# Altium project BLMC-26.PrjPcb
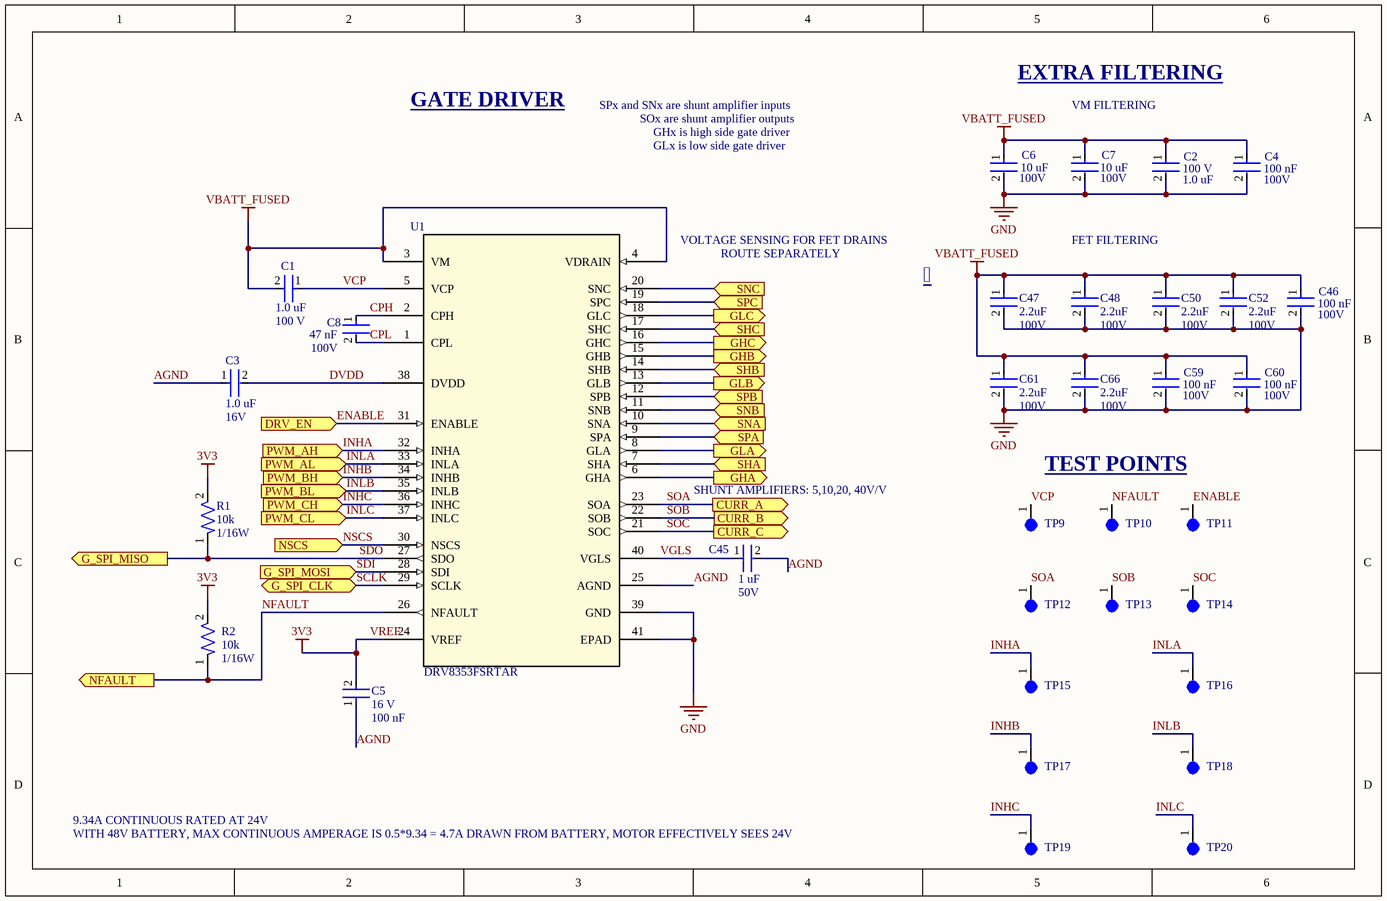
[diagram p0: Driver.SchDoc]
8 sheets, 176 parts. Net scope: flat (ports and power ports of the same name join across sheets).
Board file: BLMC-26.PcbDoc
Sheets:
  Driver.SchDoc
  FETs.SchDoc
  MCU.SchDoc
  5V_Buck.SchDoc
  LDOs.SchDoc
  CAN.SchDoc
  Encoder.SchDoc
  Connectors.SchDoc

## Sheet Driver.SchDoc
size 259 x 167 mm; SheetNumber: 1; SheetTotal: 7

### Parts
C1  Voltage: 100 V  Capacitance: 1.0 uF  [CAP-0805]  (hidden comment: 08051C105K4Z2A)
C2  Voltage: 100 V  Capacitance: 1.0 uF  [CAP-0805]  (hidden comment: 08051C105K4Z2A)
C3  Capacitance: 1.0 uF  Voltage: 16V  [CAP-0603]  (hidden comment: CC0603KRX7R7BB105)
C4  Capacitance: 100 nF  Voltage: 100V  [CAP-0603]  (hidden comment: GRM188R72A104KA35D)
C5  Voltage Rating: 16 V  Capacitance: 100 nF  [CAP-0402]  (hidden comment: CC0402KRX7R7BB104)
C6  Capcitance: 10 uF  Voltage Rating: 100V  [CAP-1210]  (hidden comment: GRM32EC72A106KE05L)
C7  Capcitance: 10 uF  Voltage Rating: 100V  [CAP-1210]  (hidden comment: GRM32EC72A106KE05L)
C8  Capacitance: 47 nF  Voltage: 100V  [CAP-0603]  (hidden comment: C0603C473K1RACTU)
C45  Capacitance: 1 uF  Voltage: 50V  [CAP-0603]  (hidden comment: UMK107AB7105KA-T)
C46  Capacitance: 100 nF  Voltage: 100V  [CAP-0603]  (hidden comment: GRM188R72A104KA35D)
C47  Capacitance: 2.2uF  Voltage: 100V  [CAP-1206]  (hidden comment: CC1206KKX7R0BB225)
C48  Capacitance: 2.2uF  Voltage: 100V  [CAP-1206]  (hidden comment: CC1206KKX7R0BB225)
C50  Capacitance: 2.2uF  Voltage: 100V  [CAP-1206]  (hidden comment: CC1206KKX7R0BB225)
C52  Capacitance: 2.2uF  Voltage: 100V  [CAP-1206]  (hidden comment: CC1206KKX7R0BB225)
C59  Capacitance: 100 nF  Voltage: 100V  [CAP-0603]  (hidden comment: GRM188R72A104KA35D)
C60  Capacitance: 100 nF  Voltage: 100V  [CAP-0603]  (hidden comment: GRM188R72A104KA35D)
C61  Capacitance: 2.2uF  Voltage: 100V  [CAP-1206]  (hidden comment: CC1206KKX7R0BB225)
C66  Capacitance: 2.2uF  Voltage: 100V  [CAP-1206]  (hidden comment: CC1206KKX7R0BB225)
R1  Resistance: 10k  Power: 1/16W  [RES-0402]  (hidden comment: RC0402FR-0710KL)
R2  Resistance: 10k  Power: 1/16W  [RES-0402]  (hidden comment: RC0402FR-0710KL)
TP9  5003  [TEST-POINT-0001]  (value not drawn)
TP10  5003  [TEST-POINT-0001]  (value not drawn)
TP11  5003  [TEST-POINT-0001]  (value not drawn)
TP12  5003  [TEST-POINT-0001]  (value not drawn)
TP13  5003  [TEST-POINT-0001]  (value not drawn)
TP14  5003  [TEST-POINT-0001]  (value not drawn)
TP15  5003  [TEST-POINT-0001]  (value not drawn)
TP16  5003  [TEST-POINT-0001]  (value not drawn)
TP17  5003  [TEST-POINT-0001]  (value not drawn)
TP18  5003  [TEST-POINT-0001]  (value not drawn)
TP19  5003  [TEST-POINT-0001]  (value not drawn)
TP20  5003  [TEST-POINT-0001]  (value not drawn)
U1  DRV8353FSRTAR  [IC-GDRV-0002]

### Ports
CURR_A (out, see MCU[1C]), CURR_B (out, see MCU[1C]), CURR_C (out, see MCU[1C]), DRV_EN (in, see MCU[4B]), G_SPI_CLK (bidir, see MCU[1B]), G_SPI_MISO (out, see MCU[1B]), G_SPI_MOSI (in, see MCU[1B]), GHA (out, see FETs[2A]), GHB (out, see FETs[4A]), GHC (out, see FETs[5A]), GLA (out, see FETs[2C]), GLB (out, see FETs[4C]), GLC (out, see FETs[5C]), NFAULT (out, see MCU[1C]), NSCS (in, see MCU[4B]), PWM_AH (in, see MCU[1B]), PWM_AL (in, see MCU[1B]), PWM_BH (in, see MCU[1D]), PWM_BL (in, see MCU[1D]), PWM_CH (in, see MCU[1D]), PWM_CL (in, see MCU[1D]), SHA (in, see Connectors[4B], FETs[1B]), SHB (in, see Connectors[4B], FETs[3B]), SHC (in, see Connectors[4B], FETs[4B]), SNA (in, see FETs[1D]), SNB (in, see FETs[2D]), SNC (in, see FETs[4D]), SPA (in, see FETs[1C]), SPB (in, see FETs[2C]), SPC (in, see FETs[4C])

### Nets
GND: C2.2 C4.2 C6.2 C7.2 C46.2 C47.2 C48.2 C50.2 C52.2 C59.2 C60.2 C61.2 C66.2 U1.39(GND) U1.41(EPAD)
VBATT_FUSED: C1.2 C2.1 C4.1 C6.1 C7.1 C46.1 C47.1 C48.1 C50.1 C52.1 C59.1 C60.1 C61.1 C66.1 U1.3(VM) U1.4(VDRAIN)
VREF: C5.2 R1.2 R2.2 U1.24(VREF)  [also labelled 3V3]
AGND: C3.1 C5.1 C45.2 U1.25(AGND)
CPH: C8.1 U1.2(CPH)
CPL: C8.2 U1.1(CPL)
DVDD: C3.2 U1.38(DVDD)
ENABLE: TP11.1 U1.31(ENABLE) ; port DRV_EN
INHA: TP15.1 U1.32(INHA) ; port PWM_AH
INHB: TP17.1 U1.34(INHB) ; port PWM_BH
INHC: TP19.1 U1.36(INHC) ; port PWM_CH
INLA: TP16.1 U1.33(INLA) ; port PWM_AL
INLB: TP18.1 U1.35(INLB) ; port PWM_BL
INLC: TP20.1 U1.37(INLC) ; port PWM_CL
MOTOR_A: U1.7(SHA) ; port SHA
MOTOR_B: U1.14(SHB) ; port SHB
MOTOR_C: U1.17(SHC) ; port SHC
NFAULT: R2.1 TP10.1 U1.26(NFAULT) ; port NFAULT
NSCS: U1.30(NSCS) ; port NSCS
SCLK: U1.29(SCLK) ; port G_SPI_CLK
SDI: U1.28(SDI) ; port G_SPI_MOSI
SDO: R1.1 U1.27(SDO) ; port G_SPI_MISO
SOA: TP12.1 U1.23(SOA) ; port CURR_A
SOB: TP13.1 U1.22(SOB) ; port CURR_B
SOC: TP14.1 U1.21(SOC) ; port CURR_C
VCP: C1.1 TP9.1 U1.5(VCP)
VGLS: C45.1 U1.40(VGLS)
NetC9_1: U1.9(SPA) ; port SPA
NetC9_2: U1.10(SNA) ; port SNA
NetC10_1: U1.12(SPB) ; port SPB
NetC10_2: U1.11(SNB) ; port SNB
NetC11_1: U1.19(SPC) ; port SPC
NetC11_2: U1.20(SNC) ; port SNC
NetR6_2: U1.6(GHA) ; port GHA
NetR7_2: U1.15(GHB) ; port GHB
NetR8_2: U1.16(GHC) ; port GHC
NetR31_2: U1.8(GLA) ; port GLA
NetR32_2: U1.13(GLB) ; port GLB
NetR36_2: U1.18(GLC) ; port GLC

### Notes on the sheet
- GATE DRIVER
- SPx and SNx are shunt amplifier inputs
- EXTRA FILTERING
- VM FILTERING
- SOx are shunt amplifier outputs
- GHx is high side gate driver
- GLx is low side gate driver
- VOLTAGE SENSING FOR FET DRAINS
- FET FILTERING
- ROUTE SEPARATELY
- 
- SHUNT AMPLIFIERS: 5,10,20, 40V/V
- TEST POINTS
- 9.34A CONTINUOUS RATED AT 24V
- WITH 48V BATTERY, MAX CONTINUOUS AMPERAGE IS 0.5*9.34 = 4.7A DRAWN FROM BATTERY, MOTOR EFFECTIVELY SEES 24V

### Library data of the parts
C1 C2 = CAP-1U-0001: CAP CER 1UF 50V X7R 0805; ComponentLink2URL: https://www.yageo.com/upload/media/product/productsearch/datasheet/mlcc/UPY-GPHC_X7R_6.3V-to-250V_24.pdf; ComponentLink2Description: Datasheet; Device Class: Ceramic; Size: 0805
C3 = CAP-1U-0002: CAP CER 1UF 16V X7R 0603; Device Class: Ceramic; Size: 0603
C4 C46 C59 C60 = CAP-1U-0002: CAP CER 100NF 100V X7R 0603; Device Class: Ceramic; Size: 0603
C5 = CAP-0.1U-0001: CAP CER 0.1UF 16V X7R 0402; ComponentLink2Description: Datasheet; ComponentLink2URL: https://www.yageo.com/upload/media/product/productsearch/datasheet/mlcc/UPY-GPHC_X7R_6.3V-to-250V_24.pdf; Device Class: Ceramic; Size: 0402
C6 C7 = CAP-10U-0003: 10 µF ±10% 100V Ceramic Capacitor X7S 1210 (3225 Metric); Package Size: 1210
C8 = CAP-4.7U-0001: CAP CER 47NF 100V X5R 0603; Device Class: Ceramic; Size: 0603
C45 = CAP-1U-0002: 1 µF ±10% 50V Ceramic Capacitor X7R 0603 (1608 Metric); Package Size: 0603
C47 C48 C50 C52 C61 C66 = CAP-2.2U-0001: CAP CER 2.2UF 100V X7R 1206; Device Class: Ceramic; Size: 1206; ComponentLink1Description: Datasheet; ComponentLink1URL: https://www.yageo.com/upload/media/product/productsearch/datasheet/mlcc/UPY-GPHC_X7R_6.3V-to-250V_24.pdf
R1 R2 = RES-10k-0001: RES 10K OHM 1% 1/16W 0402; Tolerance: 1%; Size: 0402; ComponentLink1Description: Datasheet; ComponentLink1URL: https://www.yageo.com/upload/media/product/products/datasheet/rchip/PYu-RC_Group_51_RoHS_L_12.pdf
TP9-TP20 = TEST-POINT-0001: Oranange PC Test Point, Miniature Phoisphor Bronze Silver Plating Through Hole Mounting Type
U1 = IC-GDRV-0002: 102-V MAX 3-PHASE FUNCTIONAL SAF; Manufacturer_Name: Texas Instruments; VCC-max: 102V; Type: Power Management; Copyright: Copyright (C) 2025 Ultra Librarian. All rights reserved.; Manufacturer_Part_Number: DRV8353FSRTAR; RefDes: RefDes

## Sheet FETs.SchDoc
size 259 x 167 mm; SheetNumber: 2; SheetTotal: 8
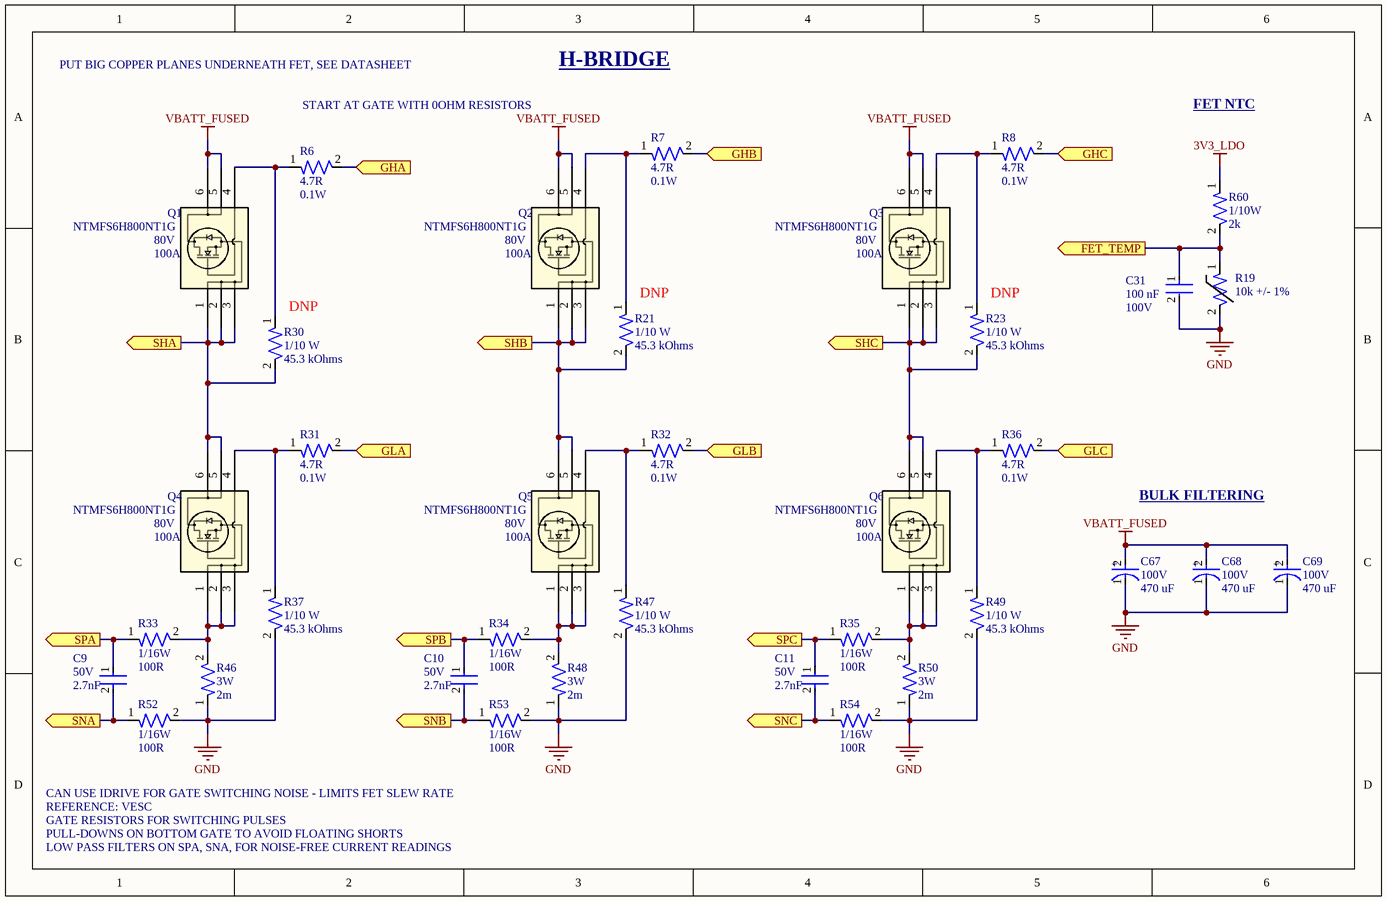
[diagram p1: FETs.SchDoc]

### Parts
C9  Voltage: 50V  Capacitance: 2.7nF  [CAP-0805]  (hidden comment: GRM2165C1H272JA01D)
C10  Voltage: 50V  Capacitance: 2.7nF  [CAP-0805]  (hidden comment: GRM2165C1H272JA01D)
C11  Voltage: 50V  Capacitance: 2.7nF  [CAP-0805]  (hidden comment: GRM2165C1H272JA01D)
C31  Capacitance: 100 nF  Voltage: 100V  [CAP-0603]  (hidden comment: GRM188R72A104KA35D)
C67  Voltage: 100V  Capacitance: 470 uF  [CAP-470U-0001]  (hidden comment: ESH477M100AM2AA)
C68  Voltage: 100V  Capacitance: 470 uF  [CAP-470U-0001]  (hidden comment: ESH477M100AM2AA)
C69  Voltage: 100V  Capacitance: 470 uF  [CAP-470U-0001]  (hidden comment: ESH477M100AM2AA)
Q1  NTMFS6H800NT1G  Vdss: 80V  Drain Current: 100A  [DFN6_5X6_SO8FL_488AA_ONS]
Q2  NTMFS6H800NT1G  Vdss: 80V  Drain Current: 100A  [DFN6_5X6_SO8FL_488AA_ONS]
Q3  NTMFS6H800NT1G  Vdss: 80V  Drain Current: 100A  [DFN6_5X6_SO8FL_488AA_ONS]
Q4  NTMFS6H800NT1G  Vdss: 80V  Drain Current: 100A  [DFN6_5X6_SO8FL_488AA_ONS]
Q5  NTMFS6H800NT1G  Vdss: 80V  Drain Current: 100A  [DFN6_5X6_SO8FL_488AA_ONS]
Q6  NTMFS6H800NT1G  Vdss: 80V  Drain Current: 100A  [DFN6_5X6_SO8FL_488AA_ONS]
R6  Resistance: 4.7R  Power: 0.1W  [RES-0603]  (hidden comment: RMCF0603FT4R70)
R7  Resistance: 4.7R  Power: 0.1W  [RES-0603]  (hidden comment: RMCF0603FT4R70)
R8  Resistance: 4.7R  Power: 0.1W  [RES-0603]  (hidden comment: RMCF0603FT4R70)
R19  Resistance: 10k +/- 1%  [RES-0603]  (hidden comment: NCU18XH103F60RB)
R21  Power: 1/10 W  Resistance: 45.3 kOhms  [RES-0603]  (hidden comment: RC0603FR-0745K3L)
R23  Power: 1/10 W  Resistance: 45.3 kOhms  [RES-0603]  (hidden comment: RC0603FR-0745K3L)
R30  Power: 1/10 W  Resistance: 45.3 kOhms  [RES-0603]  (hidden comment: RC0603FR-0745K3L)
R31  Resistance: 4.7R  Power: 0.1W  [RES-0603]  (hidden comment: RMCF0603FT4R70)
R32  Resistance: 4.7R  Power: 0.1W  [RES-0603]  (hidden comment: RMCF0603FT4R70)
R33  Power: 1/16W  Resistance: 100R  [RES-0402]  (hidden comment: RC0402FR-07100RL)
R34  Power: 1/16W  Resistance: 100R  [RES-0402]  (hidden comment: RC0402FR-07100RL)
R35  Power: 1/16W  Resistance: 100R  [RES-0402]  (hidden comment: RC0402FR-07100RL)
R36  Resistance: 4.7R  Power: 0.1W  [RES-0603]  (hidden comment: RMCF0603FT4R70)
R37  Power: 1/10 W  Resistance: 45.3 kOhms  [RES-0603]  (hidden comment: RC0603FR-0745K3L)
R46  Power: 3W  Resistance: 2m  [STA_CSNL25122_STP]  (hidden comment: CSNL2512FT2L00)
R47  Power: 1/10 W  Resistance: 45.3 kOhms  [RES-0603]  (hidden comment: RC0603FR-0745K3L)
R48  Power: 3W  Resistance: 2m  [STA_CSNL25122_STP]  (hidden comment: CSNL2512FT2L00)
R49  Power: 1/10 W  Resistance: 45.3 kOhms  [RES-0603]  (hidden comment: RC0603FR-0745K3L)
R50  Power: 3W  Resistance: 2m  [STA_CSNL25122_STP]  (hidden comment: CSNL2512FT2L00)
R52  Power: 1/16W  Resistance: 100R  [RES-0402]  (hidden comment: RC0402FR-07100RL)
R53  Power: 1/16W  Resistance: 100R  [RES-0402]  (hidden comment: RC0402FR-07100RL)
R54  Power: 1/16W  Resistance: 100R  [RES-0402]  (hidden comment: RC0402FR-07100RL)
R60  Power: 1/10W  Resistance: 2k  [RES-0603]  (hidden comment: RC0603JR-072KL)

### Ports
FET_TEMP (out, see MCU[1B], MCU[4D]), GHA (in, see Driver[4C]), GHB (in, see Driver[4B]), GHC (in, see Driver[4B]), GLA (in, see Driver[4C]), GLB (in, see Driver[4B]), GLC (in, see Driver[4B]), SHA (out, see Connectors[4B], Driver[4C]), SHB (out, see Connectors[4B], Driver[4B]), SHC (out, see Connectors[4B], Driver[4B]), SNA (out, see Driver[4B]), SNB (out, see Driver[4B]), SNC (out, see Driver[4B]), SPA (out, see Driver[4B]), SPB (out, see Driver[4B]), SPC (out, see Driver[4B])

### Nets
3V3_LDO: R60.1  [project net VBAT]
GND: C31.2 C67.1 C68.1 C69.1 R19.2 R37.2 R46.1 R47.2 R48.1 R49.2 R50.1 R52.2 R53.2 R54.2
VBATT_FUSED: C67.2 C68.2 C69.2 Q1.5 Q1.6 Q2.5 Q2.6 Q3.5 Q3.6
MOTOR_A: Q1.1 Q1.2 Q1.3 Q4.5 Q4.6 R30.2 ; port SHA
MOTOR_B: Q2.1 Q2.2 Q2.3 Q5.5 Q5.6 R21.2 ; port SHB
MOTOR_C: Q3.1 Q3.2 Q3.3 Q6.5 Q6.6 R23.2 ; port SHC
NetC9_1: C9.1 R33.1 ; port SPA
NetC9_2: C9.2 R52.1 ; port SNA
NetC10_1: C10.1 R34.1 ; port SPB
NetC10_2: C10.2 R53.1 ; port SNB
NetC11_1: C11.1 R35.1 ; port SPC
NetC11_2: C11.2 R54.1 ; port SNC
NetC31_1: C31.1 R19.1 R60.2 ; port FET_TEMP
NetQ1_4: Q1.4 R6.1 R30.1
NetQ2_4: Q2.4 R7.1 R21.1
NetQ3_4: Q3.4 R8.1 R23.1
NetQ4_1: Q4.1 Q4.2 Q4.3 R33.2 R46.2
NetQ4_4: Q4.4 R31.1 R37.1
NetQ5_1: Q5.1 Q5.2 Q5.3 R34.2 R48.2
NetQ5_4: Q5.4 R32.1 R47.1
NetQ6_1: Q6.1 Q6.2 Q6.3 R35.2 R50.2
NetQ6_4: Q6.4 R36.1 R49.1
NetR6_2: R6.2 ; port GHA
NetR7_2: R7.2 ; port GHB
NetR8_2: R8.2 ; port GHC
NetR31_2: R31.2 ; port GLA
NetR32_2: R32.2 ; port GLB
NetR36_2: R36.2 ; port GLC

### Notes on the sheet
- PUT BIG COPPER PLANES UNDERNEATH FET, SEE DATASHEET
- START AT GATE WITH 0OHM RESISTORS
- H-BRIDGE
- FET NTC
- (near R30) DNP
- (near R21) DNP
- (near R23) DNP
- BULK FILTERING
- CAN USE IDRIVE FOR GATE SWITCHING NOISE - LIMITS FET SLEW RATE
- REFERENCE: VESC
- GATE RESISTORS FOR SWITCHING PULSES
- PULL-DOWNS ON BOTTOM GATE TO AVOID FLOATING SHORTS
- LOW PASS FILTERS ON SPA, SNA, FOR NOISE-FREE CURRENT READINGS
- (in symbol CAP-470U-0001) +

### Library data of the parts
C9-C11 = CAP-2.7N-0001: CAP CER 2700PF 50V C0G/NP0 0805; ComponentLink1Description: Datasheet; ComponentLink1URL: https://search.murata.co.jp/Ceramy/image/img/A01X/G101/ENG/GRM2165C1H272JA01-01.pdf; Device Class: Ceramic; Size: 0805
C31 = CAP-1U-0002: CAP CER 100NF 100V X7R 0603; Device Class: Ceramic; Size: 0603
C67-C69 = CAP-470U-0001: CAP ALUM 470UF 20% 100V RADIAL; Device Class: Electrolytic; ComponentLink1Description: Datasheet; ComponentLink1URL: https://industrial.panasonic.com/cdbs/www-data/pdf/RDE0000/ABA0000C1190.pdf
Q1-Q6 = NTMFS6H800NT1G: N-Channel 80 V 28A (Ta), 203A (Tc) 3.8W (Ta), 200W (Tc) Surface Mount 5-DFN (5x6) (8-SOFL); Manufacturer_Part_Number: TPH2R506PL; Vgs (max): 20V; Vgs: 4V @ 1mA; RefDes: RefDes
R6-R8 R31 R32 R36 = RES-4.7-0001: 4.7 Ohms ±1% 0.1W, 1/10W Chip Resistor 0603 (1608 Metric) Automotive AEC-Q200 Thick Film; Tolerance: 1%; Size: 0402; ComponentLink1Description: Datasheet; ComponentLink1URL: https://www.yageo.com/upload/media/product/products/datasheet/rchip/PYu-RC_Group_51_RoHS_L_12.pdf
R19 = THERM-10K-0001: NTC Thermistor 10k 0603 (1608 Metric); Manufacturer Part Number: TMP6431DECR; Manufacturer: Texas Instruments; Package Size: 0402
R21 R23 R30 R37 R47 R49 = RES-45.3K-0001: 45.3 kOhms ±1% 0.1W, 1/10W Chip Resistor 0603 (1608 Metric) Moisture Resistant Thick Film; Tolerance: +/- 1%; Assembled?: no; Package Size: 0603
R33-R35 R52-R54 = RES-100-0001: RES 100 OHM 1% 1/16W 0402; Tolerance: 1%; Size: 0402; ComponentLink1Description: Datasheet; ComponentLink1URL: https://www.yageo.com/upload/media/product/products/datasheet/rchip/PYu-RC_Group_51_RoHS_L_12.pdf
R46 R48 R50 = RES-2m-0001: 2 mOhms ±1% 3W Chip Resistor 2512 (6332 Metric) Current Sense, Moisture Resistant Metal Element; Tolerance: 1%; Size: 0402; ComponentLink1Description: Datasheet; ComponentLink1URL: https://www.yageo.com/upload/media/product/products/datasheet/rchip/PYu-RC_Group_51_RoHS_L_12.pdf
R60 = RES-13.7K-0001: RES 2K OHM 5% 1/10W 0603

## Sheet MCU.SchDoc
size 259 x 167 mm; SheetNumber: 2; SheetTotal: 7
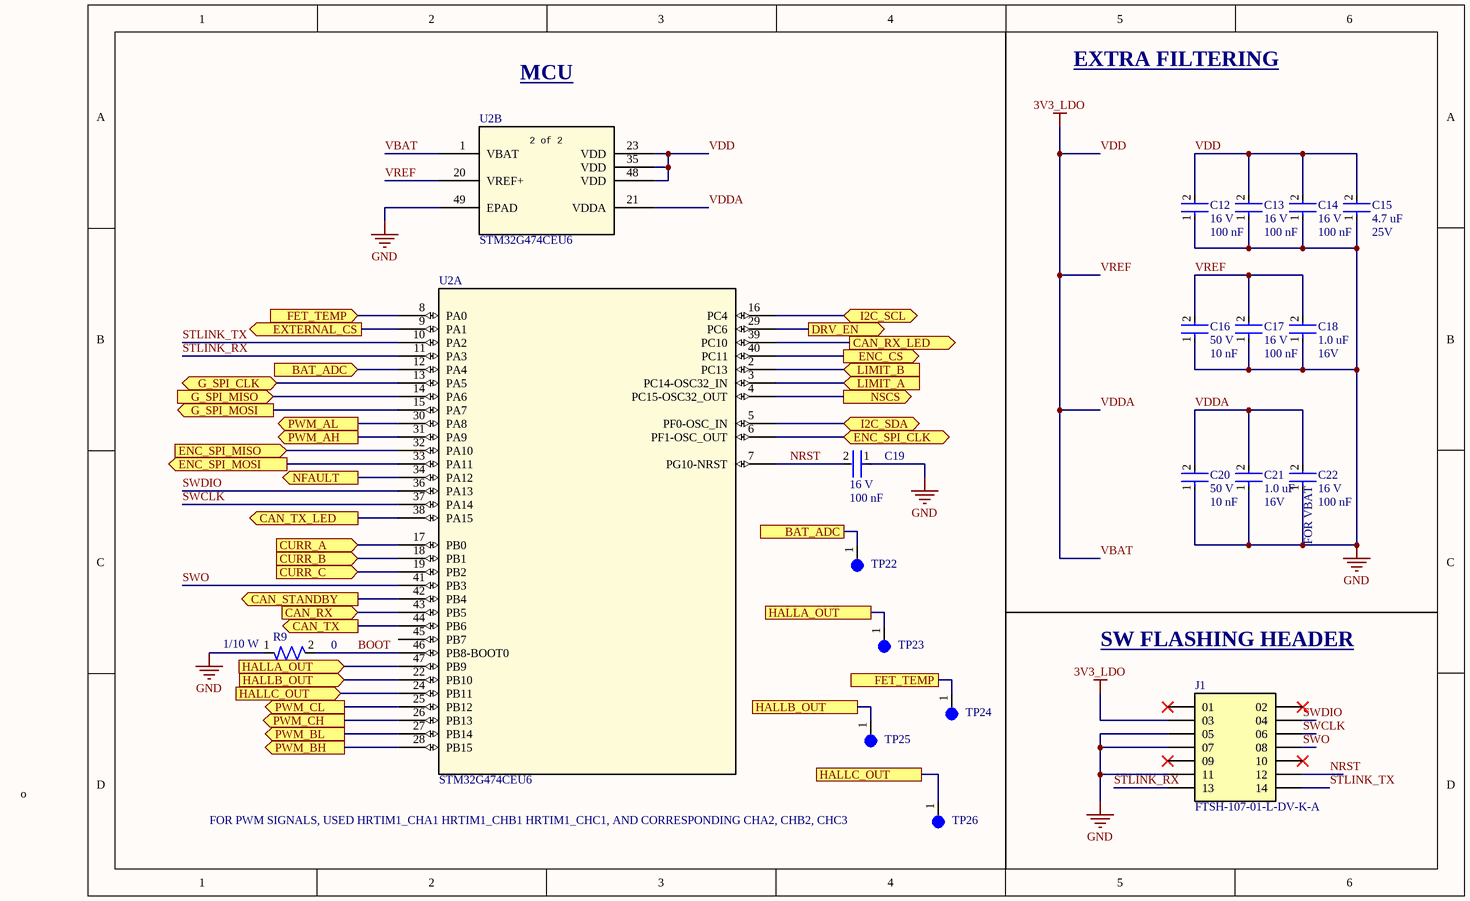
[diagram p2: MCU.SchDoc]

### Parts
C12  Voltage Rating: 16 V  Capacitance: 100 nF  [CAP-0402]  (hidden comment: CC0402KRX7R7BB104)
C13  Voltage Rating: 16 V  Capacitance: 100 nF  [CAP-0402]  (hidden comment: CC0402KRX7R7BB104)
C14  Voltage Rating: 16 V  Capacitance: 100 nF  [CAP-0402]  (hidden comment: CC0402KRX7R7BB104)
C15  Capacitance: 4.7 uF  Voltage: 25V  [CAP-0603]  (hidden comment: CC0603KRX5R8BB475)
C16  Voltage: 50 V  Capacitance: 10 nF  [CAP-0603]  (hidden comment: CC0603KPX7R9BB103)
C17  Voltage Rating: 16 V  Capacitance: 100 nF  [CAP-0402]  (hidden comment: CC0402KRX7R7BB104)
C18  Capacitance: 1.0 uF  Voltage: 16V  [CAP-0603]  (hidden comment: CC0603KRX7R7BB105)
C19  Voltage Rating: 16 V  Capacitance: 100 nF  [CAP-0402]  (hidden comment: CC0402KRX7R7BB104)
C20  Voltage: 50 V  Capacitance: 10 nF  [CAP-0603]  (hidden comment: CC0603KPX7R9BB103)
C21  Capacitance: 1.0 uF  Voltage: 16V  [CAP-0603]  (hidden comment: CC0603KRX7R7BB105)
C22  Voltage Rating: 16 V  Capacitance: 100 nF  [CAP-0402]  (hidden comment: CC0402KRX7R7BB104)
J1  FTSH-107-01-L-DV-K-A  [SAMTEC_FTSH-107-01-L-DV-K]
R9  Resistance: 0  Power: 1/10 W  [RES-0603]  (hidden comment: RMCF0603ZT0R00)
TP22  5003  [TEST-POINT-0001]  (value not drawn)
TP23  5003  [TEST-POINT-0001]  (value not drawn)
TP24  5003  [TEST-POINT-0001]  (value not drawn)
TP25  5003  [TEST-POINT-0001]  (value not drawn)
TP26  5003  [TEST-POINT-0001]  (value not drawn)
U2  STM32G474CEU6  [IC-QFPN48]  (parts A,B of 2)

### Ports
BAT_ADC (in, see Connectors[5A], MCU[3C]), BAT_ADC (see Connectors[5A], MCU[1B]), CAN_RX (in, see CAN[1B]), CAN_RX_LED (out, see CAN[6A]), CAN_STANDBY (out, see CAN[1B]), CAN_TX (out, see CAN[1B]), CAN_TX_LED (out, see CAN[4A]), CURR_A (in, see Driver[4C]), CURR_B (in, see Driver[4C]), CURR_C (in, see Driver[4C]), DRV_EN (out, see Driver[2B]), ENC_CS (out, see Encoder[2B]), ENC_SPI_CLK (bidir, see Connectors[1D], Encoder[2C]), ENC_SPI_MISO (in, see Connectors[2D], Encoder[2C]), ENC_SPI_MOSI (out, see Connectors[2D], Encoder[2C]), EXTERNAL_CS (out, see Connectors[1D]), FET_TEMP (in, see FETs[5B], MCU[4D]), FET_TEMP (see FETs[5B], MCU[1B]), G_SPI_CLK (bidir, see Driver[2C]), G_SPI_MISO (in, see Driver[1C]), G_SPI_MOSI (out, see Driver[2C]), HALLA_OUT (in, see Connectors[5C], MCU[3C]), HALLA_OUT (see Connectors[5C], MCU[1C]), HALLB_OUT (in, see Connectors[5C], MCU[3D]), HALLB_OUT (see Connectors[5C], MCU[1D]), HALLC_OUT (in, see Connectors[5D], MCU[4D]), HALLC_OUT (see Connectors[5D], MCU[1D]), I2C_SCL (bidir, see Connectors[2C]), I2C_SDA (bidir, see Connectors[1C]), LIMIT_A (in, see Connectors[2C]), LIMIT_B (in, see Connectors[3C]), NFAULT (out, see Driver[1D]), NSCS (out, see Driver[2C]), PWM_AH (out, see Driver[2C]), PWM_AL (out, see Driver[2C]), PWM_BH (out, see Driver[2C]), PWM_BL (out, see Driver[2C]), PWM_CH (out, see Driver[2C]), PWM_CL (out, see Driver[2C])

### Nets
GND: C12.1 C13.1 C14.1 C15.1 C16.1 C17.1 C18.1 C19.1 C20.1 C21.1 C22.1 J1.05 J1.07 J1.11 R9.1 U2.49(EPAD)
VBAT: C12.2 C13.2 C14.2 C15.2 C16.2 C17.2 C18.2 C20.2 C21.2 C22.2 J1.03 U2.1(VBAT) U2.20(VREF+) U2.21(VDDA) U2.23(VDD) U2.35(VDD) U2.48(VDD)  [also labelled 3V3_LDO, VDD, VDDA, VREF]
BOOT: R9.2 U2.46(PB8-BOOT0)
CLK: U2.6(PF1-OSC_OUT) ; port ENC_SPI_CLK
CSN: U2.40(PC11) ; port ENC_CS
ENABLE: U2.29(PC6) ; port DRV_EN
INHA: U2.31(PA9) ; port PWM_AH
INHB: U2.28(PB15) ; port PWM_BH
INHC: U2.26(PB13) ; port PWM_CH
INLA: U2.30(PA8) ; port PWM_AL
INLB: U2.27(PB14) ; port PWM_BL
INLC: U2.25(PB12) ; port PWM_CL
MISO: U2.32(PA10) ; port ENC_SPI_MISO
MOSI: U2.33(PA11) ; port ENC_SPI_MOSI
NFAULT: U2.34(PA12) ; port NFAULT
NRST: C19.2 J1.12 U2.7(PG10-NRST)
NSCS: U2.4(PC15-OSC32_OUT) ; port NSCS
RXD: U2.43(PB5) ; port CAN_RX
SCLK: U2.13(PA5) ; port G_SPI_CLK
SDI: U2.15(PA7) ; port G_SPI_MOSI
SDO: U2.14(PA6) ; port G_SPI_MISO
SOA: U2.17(PB0) ; port CURR_A
SOB: U2.18(PB1) ; port CURR_B
SOC: U2.19(PB2) ; port CURR_C
STB: U2.42(PB4) ; port CAN_STANDBY
STLINK_RX: J1.13 U2.11(PA3)
STLINK_TX: J1.14 U2.10(PA2)
SWCLK: J1.06 U2.37(PA14)
SWDIO: J1.04 U2.36(PA13)
SWO: J1.08 U2.41(PB3)
TXD: U2.44(PB6) ; port CAN_TX
NetC30_1: TP22.1 U2.12(PA4) ; port BAT_ADC
NetC31_1: TP24.1 U2.8(PA0) ; port FET_TEMP
NetC62_1: TP23.1 U2.47(PB9) ; port HALLA_OUT
NetC63_1: TP25.1 U2.22(PB10) ; port HALLB_OUT
NetC64_1: TP26.1 U2.24(PB11) ; port HALLC_OUT
NetJ3_2: U2.5(PF0-OSC_IN) ; port I2C_SDA
NetJ3_4: U2.16(PC4) ; port I2C_SCL
NetJ5_1: U2.3(PC14-OSC32_IN) ; port LIMIT_A
NetJ5_3: U2.2(PC13) ; port LIMIT_B
NetJ8_3: U2.9(PA1) ; port EXTERNAL_CS
NetR25_2: U2.38(PA15) ; port CAN_TX_LED
NetR26_2: U2.39(PC10) ; port CAN_RX_LED

Not connected (* = marked no-connect by the designer): J1 01* 02* 09* 10*; U2 45(PB7)

### Notes on the sheet
- MCU
- EXTRA FILTERING
- (near C22) FOR VBAT
- SW FLASHING HEADER
- o
- FOR PWM SIGNALS, USED HRTIM1_CHA1 HRTIM1_CHB1 HRTIM1_CHC1, AND CORRESPONDING CHA2, CHB2, CHC3
- (in symbol IC-STM32G474, part B) 2 of 2

### Library data of the parts
C12-C14 C17 C19 C22 = CAP-0.1U-0001: CAP CER 0.1UF 16V X7R 0402; ComponentLink2Description: Datasheet; ComponentLink2URL: https://www.yageo.com/upload/media/product/productsearch/datasheet/mlcc/UPY-GPHC_X7R_6.3V-to-250V_24.pdf; Device Class: Ceramic; Size: 0402
C15 = CAP-4.7U-0001: CAP CER 4.7UF 25V X5R 0603; Device Class: Ceramic; Size: 0603
C16 C20 = CAP-10N-0002: CAP CER 10000PF 50V X7R 0603; ComponentLink2Description: Datasheet; ComponentLink2URL: http://www.yageo.com/documents/recent/UPY-GPHC_X7R_6.3V-to-50V_18.pdf; Device Class: Ceramic; Size: 0603
C18 C21 = CAP-1U-0002: CAP CER 1UF 16V X7R 0603; Device Class: Ceramic; Size: 0603
J1 = CONN-Flashing: Connector Header Surface Mount 14 position 0.050 (1.27mm); MF: Samtec Inc.; SnapEDA_Link: https://www.snapeda.com/parts/FTSH-107-01-L-DV-K-A/Samtec+Inc./view-part/?ref=snap; Package: None; Value: *; MP: FTSH-107-01-L-DV-K-A; Check_prices: https://www.snapeda.com/parts/FTSH-107-01-L-DV-K-A/Samtec+Inc./view-part/?ref=eda; ComponentLink1Description: Datasheet; ComponentLink1URL: https://mm.digikey.com/Volume0/opasdata/d220001/medias/docus/6209/ftsh-1xx-xx-xxx-dv-xxx-xxx-x-xx-mkt.pdf?_gl=1*1c8qhrp*_up*MQ..*_gs*MQ..&gclid=Cj0KCQjwndHEBhDVARIsAGh0g3BhbAROHH0tQxim6dYiCi7CVIKM-WvKYR8T8zWoEwepZ3CPXWTcBI4aAtXsEALw_wcB&gclsrc=aw.ds&gbraid=0AAAAADrbLlju0DZp9CUD_BKsHNp-CszV5
R9 = RES-0-0001: 0 Ohms Jumper 0.1W, 1/10W Chip Resistor 0603 (1608 Metric) Automotive AEC-Q200 Thick Film; Package Size: 0603
TP22-TP26 = TEST-POINT-0001: as TP9 on sheet Driver
U2 = IC-STM32G474: ARM® Cortex®-M4F STM32G4 Microcontroller IC 32-Bit 170MHz 512KB (512K x 8) FLASH 48-UFQFPN (7x7); Manufacturer_Name: STMicroelectronics; Copyright: Copyright (C) 2025 Ultra Librarian. All rights reserved.; Manufacturer_Part_Number: STM32G474CEU6; RefDes: RefDes; Type: Type

## Sheet 5V_Buck.SchDoc
size 259 x 167 mm; SheetNumber: 3; SheetTotal: 7
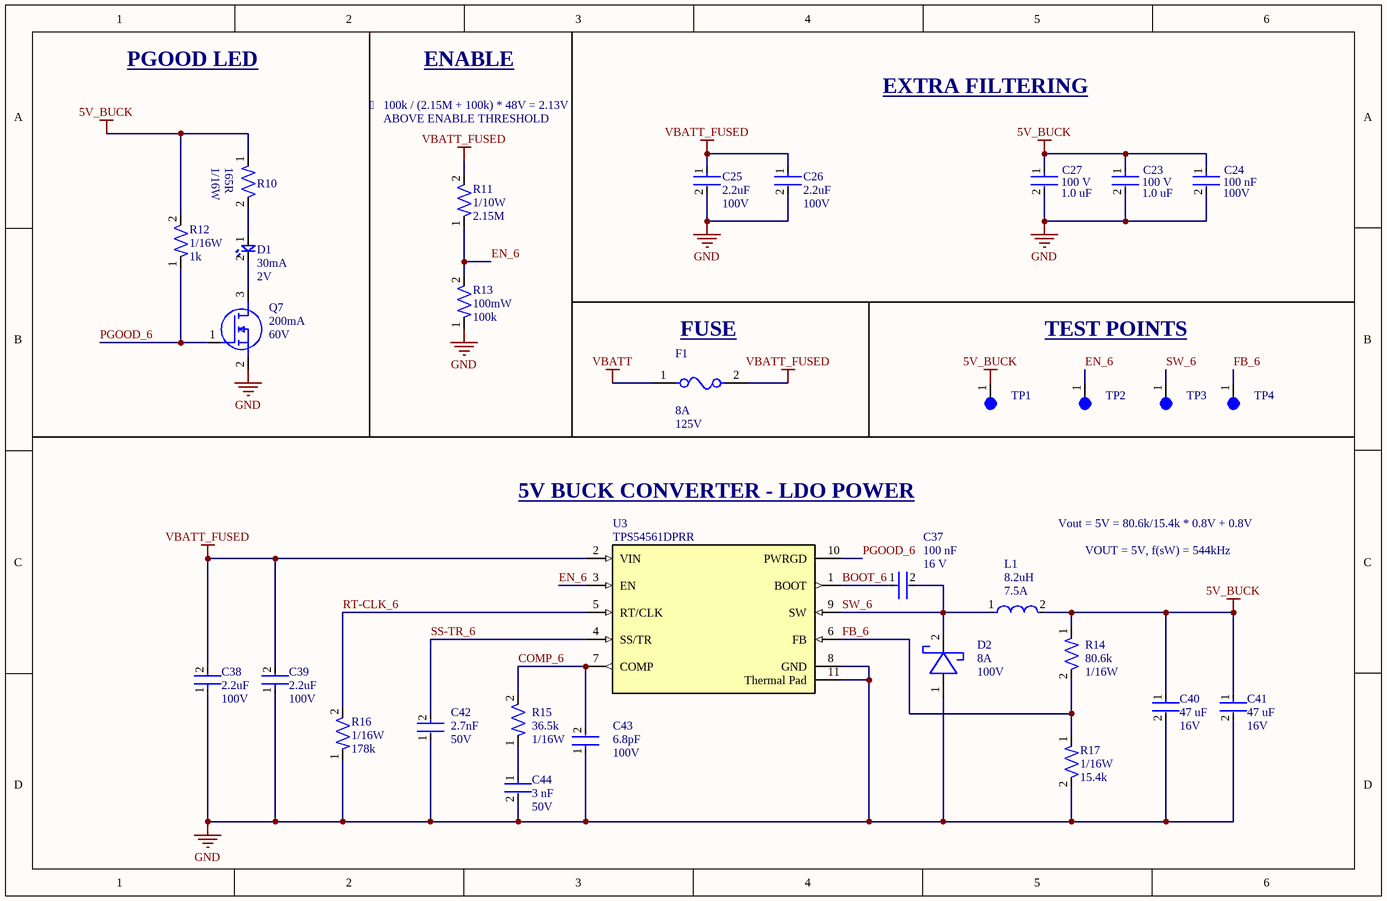
[diagram p3: 5V_Buck.SchDoc]

### Parts
C23  Voltage: 100 V  Capacitance: 1.0 uF  [CAP-0805]  (hidden comment: 08051C105K4Z2A)
C24  Capacitance: 100 nF  Voltage: 100V  [CAP-0603]  (hidden comment: GRM188R72A104KA35D)
C25  Capacitance: 2.2uF  Voltage: 100V  [CAP-1206]  (hidden comment: CC1206KKX7R0BB225)
C26  Capacitance: 2.2uF  Voltage: 100V  [CAP-1206]  (hidden comment: CC1206KKX7R0BB225)
C27  Voltage: 100 V  Capacitance: 1.0 uF  [CAP-0805]  (hidden comment: 08051C105K4Z2A)
C37  Voltage Rating: 16 V  Capacitance: 100 nF  [CAP-0402]  (hidden comment: CC0402KRX7R7BB104)
C38  Capacitance: 2.2uF  Voltage: 100V  [CAP-1206]  (hidden comment: CC1206KKX7R0BB225)
C39  Capacitance: 2.2uF  Voltage: 100V  [CAP-1206]  (hidden comment: CC1206KKX7R0BB225)
C40  Capacitance: 47 uF  Voltage: 16V  [CAP-1210]  (hidden comment: GRM32ER61C476KE15L)
C41  Capacitance: 47 uF  Voltage: 16V  [CAP-1210]  (hidden comment: GRM32ER61C476KE15L)
C42  Voltage: 50V  Capacitance: 2.7nF  [CAP-0805]  (hidden comment: GRM2165C1H272JA01D)
C43  Voltage: 100V  Capacitance: 6.8pF  [CAP-0603]  (hidden comment: CC0603CRNPO0BN6R8)
C44  Voltage: 50V  Capacitance: 3 nF  [CAP-0603]  (hidden comment: GRM1885C1H302JA01D)
D1  Forward Current: 30mA  Forward Voltage: 2V  [LED-0603]  (hidden comment: BL-HKC36G-AV-TRB)
D2  Forward Current: 8A  Reverse Voltage (DC): 100V  [DO-POWERDI5]  (hidden comment: SDT8A100P5-7)
F1  Fuse Current: 8A  Voltage Rating: 125V  [FUSE-0001]  (hidden comment: 01550900M)
L1  Inductance: 8.2uH  Current Rating: 7.5A  [IND25X25CZ]  (hidden comment: IHLP2525CZER8R2M01)
Q7  Continuous Current: 200mA  Voltage: 60V  [IC-SOT23-3]  (hidden comment: T2N7002AK,LM)
R10  RC0402FR-07165RL  [RES-0402]  (value not drawn)
R11  Power: 1/10W  Resistance: 2.15M  [RES-0603]  (hidden comment: RC0603FR-072M15L)
R12  Power: 1/16W  Resistance: 1k  [RES-0402]  (hidden comment: RC0402FR-071KL)
R13  Power: 100mW  Resistance: 100k  [RES-0603]  (hidden comment: RC0603FR-07100KL)
R14  Resistance: 80.6k  Power: 1/16W  [RES-0402]  (hidden comment: RC0402FR-0780K6L)
R15  Power: 1/16W  Resistance: 36.5k  [RES-0402]  (hidden comment: RC0402FR-0736K5L)
R16  Power: 1/16W  Resistance: 178k  [RES-0402]  (hidden comment: RTT021783FTH)
R17  Power: 1/16W  Resistance: 15.4k  [RES-0402]  (hidden comment: AC0402FR-0715K4L)
TP1  5003  [TEST-POINT-0001]  (value not drawn)
TP2  5003  [TEST-POINT-0001]  (value not drawn)
TP3  5003  [TEST-POINT-0001]  (value not drawn)
TP4  5003  [TEST-POINT-0001]  (value not drawn)
U3  TPS54561DPRR  [IC-10WSON]

### Nets
5V_BUCK: C23.1 C24.1 C27.1 C40.1 C41.1 L1.2 R10.1 R12.2 R14.1 TP1.1
GND: C23.2 C24.2 C25.2 C26.2 C27.2 C38.1 C39.1 C40.2 C41.2 C42.1 C43.1 C44.2 D2.1(CATHODE) Q7.2(S) R13.1 R16.1 R17.2 U3.8(GND) U3.11(Thermal_Pad)
VBATT: F1.1
VBATT_FUSED: C25.1 C26.1 C38.2 C39.2 F1.2 R11.2 U3.2(VIN)
BOOT_6: C37.1 U3.1(BOOT)
COMP_6: C43.2 R15.2 U3.7(COMP)
EN_6: R11.1 R13.2 TP2.1 U3.3(EN)
FB_6: R14.2 R17.1 TP4.1 U3.6(FB)
PGOOD_6: Q7.1(G) R12.1 U3.10(PWRGD)
RT-CLK_6: R16.2 U3.5(RT/CLK)
SS-TR_6: C42.2 U3.4(SS/TR)
SW_6: C37.2 D2.2(ANODE) L1.1 TP3.1 U3.9(SW)
NetC44_1: C44.1 R15.1
NetD1_1: D1.1 R10.2
NetD1_2: D1.2 Q7.3(D)

### Notes on the sheet
- PGOOD LED
- 
- 100k / (2.15M + 100k) * 48V = 2.13V
- ENABLE
- EXTRA FILTERING
- ABOVE ENABLE THRESHOLD
- (near F1) FUSE
- TEST POINTS
- 5V BUCK CONVERTER - LDO POWER
- Vout = 5V = 80.6k/15.4k * 0.8V + 0.8V
- VOUT = 5V, f(sW) = 544kHz
- (in symbol RES-165-0001) 1/16W; 165R

### Library data of the parts
C23 C27 = CAP-1U-0001: CAP CER 1UF 50V X7R 0805; ComponentLink2URL: https://www.yageo.com/upload/media/product/productsearch/datasheet/mlcc/UPY-GPHC_X7R_6.3V-to-250V_24.pdf; ComponentLink2Description: Datasheet; Device Class: Ceramic; Size: 0805
C24 = CAP-1U-0002: CAP CER 100NF 100V X7R 0603; Device Class: Ceramic; Size: 0603
C25 C26 C38 C39 = CAP-2.2U-0001: CAP CER 2.2UF 100V X7R 1206; Device Class: Ceramic; Size: 1206; ComponentLink1Description: Datasheet; ComponentLink1URL: https://www.yageo.com/upload/media/product/productsearch/datasheet/mlcc/UPY-GPHC_X7R_6.3V-to-250V_24.pdf
C37 = CAP-0.1U-0001: CAP CER 0.1UF 16V X7R 0402; ComponentLink2Description: Datasheet; ComponentLink2URL: https://www.yageo.com/upload/media/product/productsearch/datasheet/mlcc/UPY-GPHC_X7R_6.3V-to-250V_24.pdf; Device Class: Ceramic; Size: 0402
C40 C41 = CAP-47U-0002: CAP CER 47UF 16V X5R 1210; Device Class: Ceramic; Size: 1210; ComponentLink1Description: Datasheet; ComponentLink1URL: https://search.murata.co.jp/Ceramy/image/img/A01X/G101/ENG/GRM32ER61C476KE15-01.pdf
C42 = CAP-2.7N-0001: CAP CER 2700PF 50V C0G/NP0 0805; ComponentLink1Description: Datasheet; ComponentLink1URL: https://search.murata.co.jp/Ceramy/image/img/A01X/G101/ENG/GRM2165C1H272JA01-01.pdf; Device Class: Ceramic; Size: 0805
C43 = CAP-6.8P-0001: CAP CER 6.8PF 100V C0G/NPO 0603; Device Class: Ceramic; ComponentLink1Description: Datasheet; ComponentLink1URL: https://www.yageo.com/upload/media/product/productsearch/datasheet/mlcc/UPY-GPHC_X7R_6.3V-to-250V_24.pdf; Size: 0603
C44 = CAP-3N-0001: 3000 pF ±5% 50V Ceramic Capacitor C0G, NP0 0603 (1608 Metric); Device Class: Ceramic; Size: 1210; ComponentLink1Description: Datasheet; ComponentLink1URL: https://mm.digikey.com/Volume0/opasdata/d220001/medias/docus/41/CL32B106KBJNNNE_Spec.pdf
D1 = LED-0001: LED YELLOW CLEAR 0603 SMD; ComponentLink1Description: Datasheet; ComponentLink1URL: https://www.americanbrightled.com/pdffiles/led-components/smt/BL-HKC36G-AV-TRB.pdf
D2 = DIO-SCHOTTKY-0001: DIODE SCHOTTKY 100V 8A POWERDI5; ComponentLink1Description: Datasheet; ComponentLink1URL: https://www.diodes.com/assets/Datasheets/PDS760.pdf
F1 = FUSE-0001: FUSE BLOK CARTRIDGE 125V 10A SMD; ComponentLink2Description: Datasheet; ComponentLink2URL: https://www.littelfuse.com/~/media/electronics/datasheets/fuses/littelfuse_fuse_154_154t_154l_154tl_datasheet.pdf.pdf
L1 = IND-8.2U-0001: 8.2 µH Shielded Molded Inductor 4 A 68mOhm Max Nonstandard; ComponentLink1Description: Datasheet; ComponentLink1URL: https://products.sumida.com/products/pdf/CDRH104.pdf
Q7 = NMOS-200MA-0001: MOSFET N-CH 60V 200MA SOT23; ComponentLink1Description: Datasheet; ComponentLink1URL: https://toshiba.semicon-storage.com/info/T2N7002AK_datasheet_en_20150401.pdf?did=29712&prodName=T2N7002AK
R10 = RES-165-0001: RES 165 OHM 1% 1/16W 0402; Package: None; Price: None; Value: *; MP: RC0402FR-07165RL; Availability: Unavailable
R11 = RES-2.15M-0001: RES SMD 2.15M OHM 1% 1/10W 0603; Tolerance: 1%; Size: 0603; ComponentLink1Description: Datasheet; ComponentLink1URL: https://www.yageo.com/upload/media/product/products/datasheet/rchip/PYu-RC_Group_51_RoHS_L_12.pdf
R12 = RES-1k-0001: RES 1K OHM 1% 1/16W 0402; Tolerance: 1%; Size: 0402; ComponentLink1Description: Datasheet; ComponentLink1URL: https://www.yageo.com/upload/media/product/products/datasheet/rchip/PYu-RC_Group_51_RoHS_L_12.pdf
R13 = RES-100k-0001: RES SMD 100K OHM 1% 1/10W 0603; Tolerance: 1%; Size: 0603; ComponentLink1Description: Datasheet; ComponentLink1URL: https://www.yageo.com/upload/media/product/products/datasheet/rchip/PYu-RC_Group_51_RoHS_L_12.pdf
R14 = RES-80.6k-0001: 80.6 kOhms ±1% 0.063W, 1/16W Chip Resistor 0402 (1005 Metric) Moisture Resistant Thick Film; Tolerance: 1%; Size: 0402; ComponentLink1Description: Datasheet; ComponentLink1URL: https://www.yageo.com/upload/media/product/products/datasheet/rchip/PYu-RC_Group_51_RoHS_L_12.pdf
R15 = RES-36.5k-0001: 36.5 kOhms ±1% 0.063W, 1/16W Chip Resistor 0402 (1005 Metric) Moisture Resistant Thick Film; Parameter 1: *
R16 = RES-178k-0001_1: 62.5mW Thick Film Resistors 50V ±100ppm/℃ ±1% 178kΩ 0402 Chip Resistor - Surface Mount ROHS; Tolerance: 1%; Size: 0402; ComponentLink1Description: Datasheet; ComponentLink1URL: https://www.lcsc.com/datasheet/lcsc_datasheet_2304140030_RALEC-RTT021783FTH_C102842.pdf
R17 = RES-15.4K-0001: RES 15.4kΩ ±1% 0.063W 0402; Tolerance: 1%; Size: 0402; ComponentLink1Description: Datasheet; ComponentLink1URL: https://www.yageo.com/upload/media/product/productsearch/datasheet/rchip/PYu-AC_51_RoHS_L_10.pdf
TP1-TP4 = TEST-POINT-0001: as TP9 on sheet Driver
U3 = IC-BUCK-0001: IC REG BUCK ADJ 5A 10WSON; ComponentLink1Description: Datasheet; ComponentLink1URL: https://www.ti.com/general/docs/suppproductinfo.tsp?distId=10&gotoUrl=https%3A%2F%2Fwww.ti.com%2Flit%2Fgpn%2Ftps54561

## Sheet LDOs.SchDoc
size 259 x 167 mm; SheetNumber: 4; SheetTotal: 7
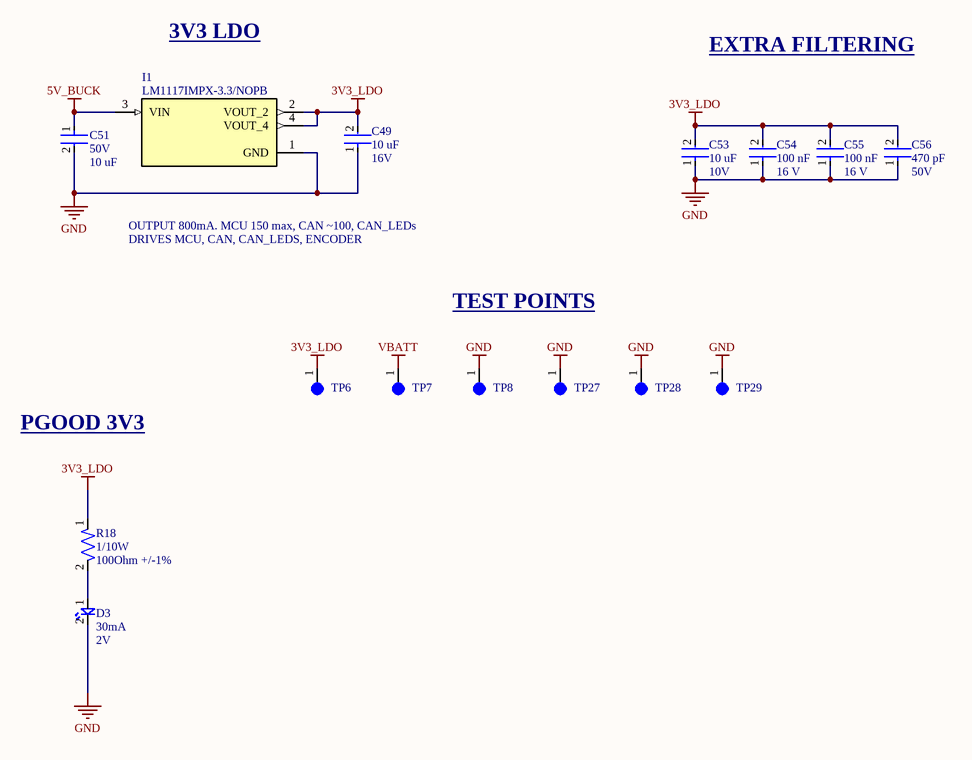
[diagram p4: LDOs.SchDoc]

### Parts
C49  Voltage: 16V  Capacitance: 10 uF  [CAP-1210]  (hidden comment: 293D106X9016A2TE3)
C51  Voltage: 50V  Capacitance: 10 uF  [CAP-1210]  (hidden comment: CL32B106KBJNNNE)
C53  Voltage: 10V  Capacitance: 10 uF  [CAP-0603]  (hidden comment: CC0603KRX5R6BB106)
C54  Voltage Rating: 16 V  Capacitance: 100 nF  [CAP-0402]  (hidden comment: CC0402KRX7R7BB104)
C55  Voltage Rating: 16 V  Capacitance: 100 nF  [CAP-0402]  (hidden comment: CC0402KRX7R7BB104)
C56  Voltage: 50V  Capacitance: 470 pF  [CAP-0805]  (hidden comment: CC0805JRNPO9BN471)
D3  Forward Current: 30mA  Forward Voltage: 2V  [LED-0603]  (hidden comment: BL-HKC36G-AV-TRB)
I1  LM1117IMPX-3.3/NOPB  [IC-SOT-223-4]
R18  Power Rating: 1/10W  Resistance: 100Ohm +/-1%  [RES-0603]  (hidden comment: AC0603FR-10100RL)
TP6  5003  [TEST-POINT-0001]  (value not drawn)
TP7  5003  [TEST-POINT-0001]  (value not drawn)
TP8  5003  [TEST-POINT-0001]  (value not drawn)
TP27  5003  [TEST-POINT-0001]  (value not drawn)
TP28  5003  [TEST-POINT-0001]  (value not drawn)
TP29  5003  [TEST-POINT-0001]  (value not drawn)

### Nets
3V3_LDO: C49.2 C53.2 C54.2 C55.2 C56.2 I1.2(VOUT_2) I1.4(VOUT_4) R18.1 TP6.1  [project net VBAT]
5V_BUCK: C51.1 I1.3(VIN)
GND: C49.1 C51.2 C53.1 C54.1 C55.1 C56.1 D3.2 I1.1(GND) TP8.1 TP27.1 TP28.1 TP29.1
VBATT: TP7.1
NetD3_1: D3.1 R18.2

### Notes on the sheet
- 3V3 LDO
- EXTRA FILTERING
- DRIVES MCU, CAN, CAN_LEDS, ENCODER
- OUTPUT 800mA. MCU 150 max, CAN ~100, CAN_LEDs
- TEST POINTS
- PGOOD 3V3

### Library data of the parts
C49 = CAP-10U-0003: CAP TANT 10UF 10% 16V 1206; Device Class: Tantalum; Size: 1206; ComponentLink1Description: Datasheet; ComponentLink1URL: https://www.lcsc.com/datasheet/lcsc_datasheet_2304140030_Vishay-Intertech-293D106X9016A2TE3_C110038.pdf
C51 = CAP-10U-0002: CAP CER 10UF 50V X7R 1210; Device Class: Ceramic; Size: 1210; ComponentLink1Description: Datasheet; ComponentLink1URL: https://mm.digikey.com/Volume0/opasdata/d220001/medias/docus/41/CL32B106KBJNNNE_Spec.pdf
C53 = CAP-10U-0001: CAP CER 10UF 10V X5R 0603; ComponentLink1Description: Datasheet; ComponentLink1URL: https://www.yageo.com/upload/media/product/app/datasheet/mlcc/upy-gphc_x5r_4v-to-50v.pdf; Device Class: Ceramic; Size: 0603
C54 C55 = CAP-0.1U-0001: CAP CER 0.1UF 16V X7R 0402; ComponentLink2Description: Datasheet; ComponentLink2URL: https://www.yageo.com/upload/media/product/productsearch/datasheet/mlcc/UPY-GPHC_X7R_6.3V-to-250V_24.pdf; Device Class: Ceramic; Size: 0402
C56 = CAP-470P-0001: CAP CER 470PF 50V C0G/NPO 0805; Device Class: Ceramic; Size: 0805; ComponentLink1Description: Datasheet; ComponentLink1URL: https://www.yageo.com/upload/media/product/productsearch/datasheet/mlcc/UPY-GP_NP0_16V-to-50V_18.pdf
D3 = LED-0001: LED YELLOW CLEAR 0603 SMD; ComponentLink1Description: Datasheet; ComponentLink1URL: https://www.americanbrightled.com/pdffiles/led-components/smt/BL-HKC36G-AV-TRB.pdf
I1 = IC_LDO_3V3_0001: IC REG LIN 3.3V 800MA SOT223-4; ComponentLink1Description: New link; ComponentLink1URL: https://www.ti.com/lit/ds/symlink/lm1117.pdf?HQS=dis-dk-null-digikeymode-dsf-pf-null-wwe&ts=1721700739746
R18 = RES-100-0002: 100 Ohms ±1% 0.1W, 1/10W Chip Resistor 0603 (1608 Metric) Automotive AEC-Q200 Thick Film; Manufacturer: YAGEO; Assembled?: no; Manufacturer Part Number: AC0603FR-10100RL; Package Size: 0603
TP6-TP8 TP27-TP29 = TEST-POINT-0001: as TP9 on sheet Driver

## Sheet CAN.SchDoc
size 259 x 167 mm; SheetNumber: 5; SheetTotal: 7
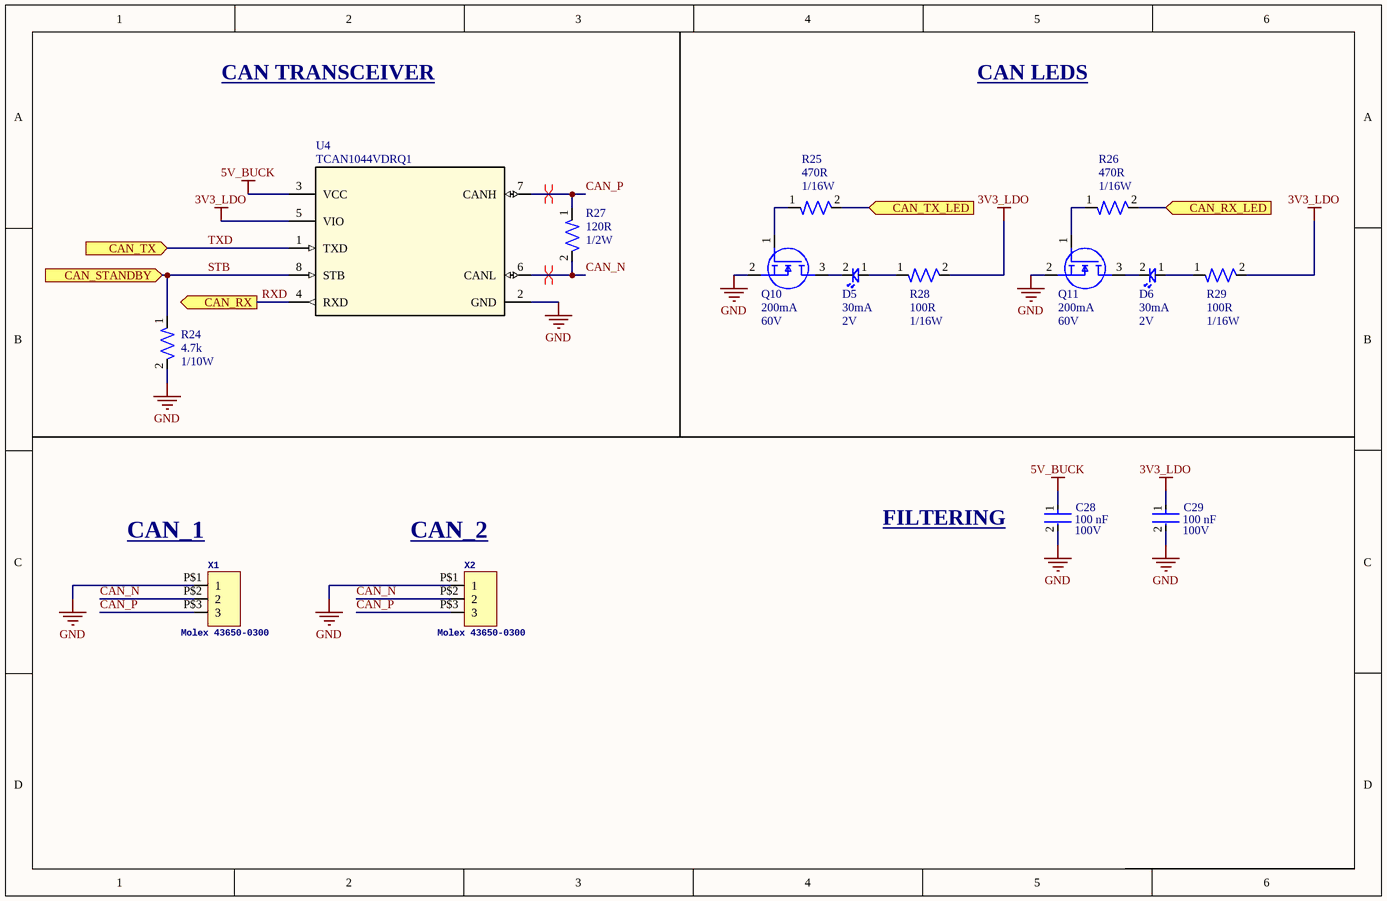
[diagram p5: CAN.SchDoc]

### Parts
C28  Capacitance: 100 nF  Voltage: 100V  [CAP-0603]  (hidden comment: GRM188R72A104KA35D)
C29  Capacitance: 100 nF  Voltage: 100V  [CAP-0603]  (hidden comment: GRM188R72A104KA35D)
D5  Forward Current: 30mA  Forward Voltage: 2V  [LED-0603]  (hidden comment: BL-HKC36G-AV-TRB)
D6  Forward Current: 30mA  Forward Voltage: 2V  [LED-0603]  (hidden comment: BL-HKC36G-AV-TRB)
Q10  Continuous Current: 200mA  Voltage: 60V  [IC-SOT23-3]  (hidden comment: T2N7002AK,LM)
Q11  Continuous Current: 200mA  Voltage: 60V  [IC-SOT23-3]  (hidden comment: T2N7002AK,LM)
R24  Power: 1/10W  Resistance: 4.7k  [RES-0603]  (hidden comment: RC0603FR-074K7L)
R25  Power: 1/16W  Resistance: 470R  [RES-0402]  (hidden comment: RC0402FR-07470RL)
R26  Power: 1/16W  Resistance: 470R  [RES-0402]  (hidden comment: RC0402FR-07470RL)
R27  Power: 1/2W  Resistance: 120R  [RES-1210]  (hidden comment: RC1210FR-07120RL)
R28  Power: 1/16W  Resistance: 100R  [RES-0402]  (hidden comment: RC0402FR-07100RL)
R29  Power: 1/16W  Resistance: 100R  [RES-0402]  (hidden comment: RC0402FR-07100RL)
U4  TCAN1044VDRQ1  [IC-8SOIC]
X1  Molex 43650-0300  [43650-0300]
X2  Molex 43650-0300  [43650-0300]

### Ports
CAN_RX (out, see MCU[1C]), CAN_RX_LED (in, see MCU[4B]), CAN_STANDBY (in, see MCU[1C]), CAN_TX (in, see MCU[1C]), CAN_TX_LED (in, see MCU[1C])

### Nets
3V3_LDO: C29.1 R28.2 R29.2 U4.5(VIO)  [project net VBAT]
5V_BUCK: C28.1 U4.3(VCC)
GND: C28.2 C29.2 Q10.2(S) Q11.2(S) R24.2 U4.2(GND) X1.P$1(1) X2.P$1(1)
CAN_N: R27.2 U4.6(CANL) X1.P$2(2) X2.P$2(2)
CAN_P: R27.1 U4.7(CANH) X1.P$3(3) X2.P$3(3)
RXD: U4.4(RXD) ; port CAN_RX
STB: R24.1 U4.8(STB) ; port CAN_STANDBY
TXD: U4.1(TXD) ; port CAN_TX
NetD5_1: D5.1 R28.1
NetD5_2: D5.2 Q10.3(D)
NetD6_1: D6.1 R29.1
NetD6_2: D6.2 Q11.3(D)
NetQ10_1: Q10.1(G) R25.1
NetQ11_1: Q11.1(G) R26.1
NetR25_2: R25.2 ; port CAN_TX_LED
NetR26_2: R26.2 ; port CAN_RX_LED

### Layout directives
differential pair: CAN_N, CAN_P

### Notes on the sheet
- CAN TRANSCEIVER
- CAN LEDS
- (near X1) CAN_1
- (near X2) CAN_2
- FILTERING

### Library data of the parts
C28 C29 = CAP-1U-0002: CAP CER 100NF 100V X7R 0603; Device Class: Ceramic; Size: 0603
D5 D6 = LED-0001: LED YELLOW CLEAR 0603 SMD; ComponentLink1Description: Datasheet; ComponentLink1URL: https://www.americanbrightled.com/pdffiles/led-components/smt/BL-HKC36G-AV-TRB.pdf
Q10 Q11 = NMOS-200MA-0001: MOSFET N-CH 60V 200MA SOT23; ComponentLink1Description: Datasheet; ComponentLink1URL: https://toshiba.semicon-storage.com/info/T2N7002AK_datasheet_en_20150401.pdf?did=29712&prodName=T2N7002AK
R24 = RES-4.7k-0001: RES 4.7K OHM 1% 1/10W 0603; Tolerance: 1%; Size: 0603; ComponentLink1Description: Datasheet; ComponentLink1URL: https://www.yageo.com/upload/media/product/products/datasheet/rchip/PYu-RC_Group_51_RoHS_L_12.pdf
R25 R26 = RES-470-0001: RES 470 OHM 1% 1/16W 0402; Tolerance: 1%; Size: 0402; ComponentLink1Description: Datasheet; ComponentLink1URL: https://www.yageo.com/upload/media/product/products/datasheet/rchip/PYu-RC_Group_51_RoHS_L_12.pdf
R27 = RES-120-0001: RES 120 OHM 1% 1/2W 1210; Tolerance: 1%; Size: 1210; ComponentLink1Description: Datasheet; ComponentLink1URL: https://www.yageo.com/upload/media/product/products/datasheet/rchip/PYu-RC_Group_51_RoHS_L_12.pdf
R28 R29 = RES-100-0001: RES 100 OHM 1% 1/16W 0402; Tolerance: 1%; Size: 0402; ComponentLink1Description: Datasheet; ComponentLink1URL: https://www.yageo.com/upload/media/product/products/datasheet/rchip/PYu-RC_Group_51_RoHS_L_12.pdf
U4 = IC-CAN-0001: IC TRANSCEIVER 1/1 8SOIC; ComponentLink1Description: Datasheet; ComponentLink1URL: https://www.ti.com/lit/ds/symlink/tcan1044-q1.pdf?HQS=dis-dk-null-digikeymode-dsf-pf-null-wwe&ts=1728758303289&ref_url=https%253A%252F%252Fwww.ti.com%252Fgeneral%252Fdocs%252Fsuppproductinfo.tsp%253FdistId%253D10%2526gotoUrl%253Dhttps%253A%252F%252Fwww.ti.com%252Flit%252Fgpn%252Ftcan1044-q1
X1 X2 = Micro-Fit Molex 3 Pin Right Angle: GateName_1: G$1; SymbolName_1: HEADER_POS3; DeviceSetName: HEADER_POS3_?; DeviceName: 43650-0300; LibraryName: con-molex-micro-fit-3_0_2; Package: 43650-0300

## Sheet Encoder.SchDoc
size 259 x 167 mm; SheetNumber: 6; SheetTotal: 7
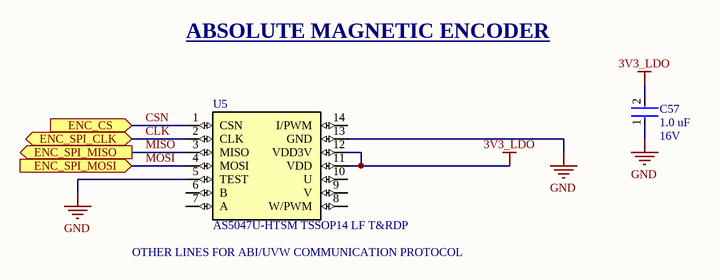
[diagram p6: Encoder.SchDoc]

### Parts
C57  Capacitance: 1.0 uF  Voltage: 16V  [CAP-0603]  (hidden comment: CC0603KRX7R7BB105)
U5  AS5047U-HTSM TSSOP14 LF T&RDP  [SOP65P640X110-14N]

### Ports
ENC_CS (in, see MCU[4B]), ENC_SPI_CLK (bidir, see Connectors[1D], MCU[4B]), ENC_SPI_MISO (out, see Connectors[2D], MCU[1C]), ENC_SPI_MOSI (in, see Connectors[2D], MCU[1C])

### Nets
3V3_LDO: C57.2 U5.11(VDD) U5.12(VDD3V)  [project net VBAT]
GND: C57.1 U5.5(TEST) U5.13(GND)
CLK: U5.2(CLK) ; port ENC_SPI_CLK
CSN: U5.1(CSN) ; port ENC_CS
MISO: U5.3(MISO) ; port ENC_SPI_MISO
MOSI: U5.4(MOSI) ; port ENC_SPI_MOSI

Not connected (* = marked no-connect by the designer): U5 6(B) 7(A) 8(W/PWM) 9(V) 10(U) 14(I/PWM)

### Notes on the sheet
- ABSOLUTE MAGNETIC ENCODER
- (near U5) OTHER LINES FOR ABI/UVW COMMUNICATION PROTOCOL

### Library data of the parts
C57 = CAP-1U-0002: CAP CER 1UF 16V X7R 0603; Device Class: Ceramic; Size: 0603
U5 = IC-ABSENC-0001: Hall Effect Sensor Rotary Position External Magnet, Not Included Gull Wing

## Sheet Connectors.SchDoc
size 259 x 167 mm; SheetNumber: 7; SheetTotal: 7
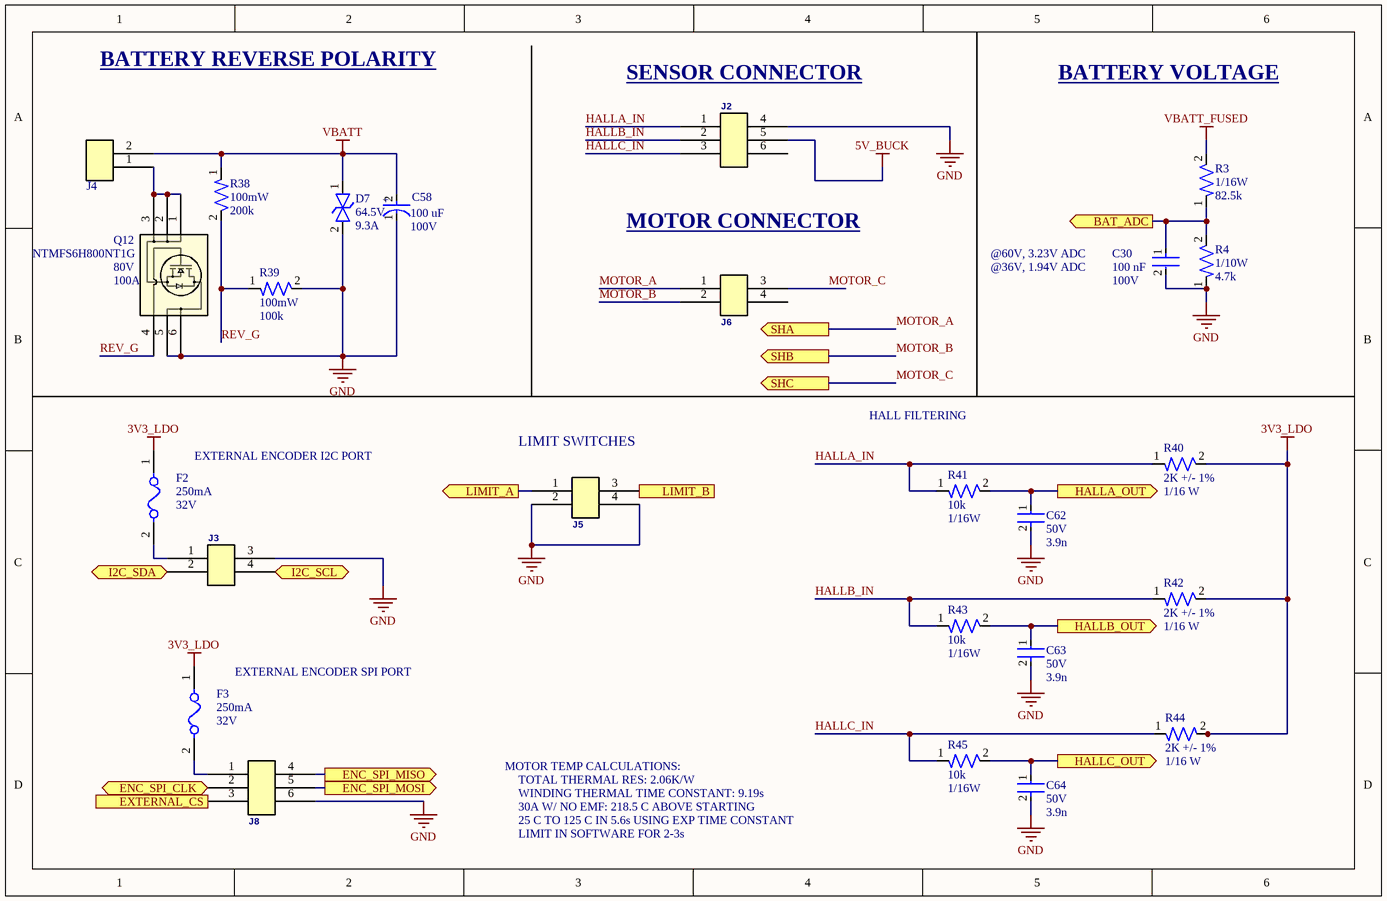
[diagram p7: Connectors.SchDoc]

### Parts
C30  Capacitance: 100 nF  Voltage: 100V  [CAP-0603]  (hidden comment: GRM188R72A104KA35D)
C58  Voltage: 100V  Capacitance: 100 uF  [CAP-100U-0001]  (hidden comment: EEETK2A101AM)
C62  Voltage: 50V  Capacitance: 3.9n  [CAP-0402]  (hidden comment: CC0402JRX7R9BB392)
C63  Voltage: 50V  Capacitance: 3.9n  [CAP-0402]  (hidden comment: CC0402JRX7R9BB392)
C64  Voltage: 50V  Capacitance: 3.9n  [CAP-0402]  (hidden comment: CC0402JRX7R9BB392)
D7  Voltage Rating: 64.5V  Current Rating: 9.3A  [DO-214AA (SMBJ)]  (hidden comment: SMBJ40CA)
F2  Fuse Current: 250mA  Voltage Rating: 32V  [RES-0603]  (hidden comment: 0467.250NRHF)
F3  Fuse Current: 250mA  Voltage Rating: 32V  [RES-0603]  (hidden comment: 0467.250NRHF)
J2  Molex 43045-0612  [CONN-6POS-0001]  (value not drawn)
J3  Molex 43045-0412  [CONN-4POS-0002]  (value not drawn)
J4  1546927-2  [CONN-1546927-2]  (value not drawn)
J5  Molex 43045-0412  [CONN-4POS-0002]  (value not drawn)
J6  Molex 43045-0412  [CONN-4POS-0002]  (value not drawn)
J8  Molex 43045-0612  [CONN-6POS-0001]  (value not drawn)
Q12  NTMFS6H800NT1G  Vdss: 80V  Drain Current: 100A  [DFN6_5X6_SO8FL_488AA_ONS]
R3  Power: 1/16W  Resistance: 82.5k  [RES-0402]  (hidden comment: RC0402FR-0782K5L)
R4  Power: 1/10W  Resistance: 4.7k  [RES-0603]  (hidden comment: RC0603FR-074K7L)
R38  Power: 100mW  Resistance: 200k  [RES-0603]  (hidden comment: RC0603FR-07200KL)
R39  Power: 100mW  Resistance: 100k  [RES-0603]  (hidden comment: RC0603FR-07100KL)
R40  Resistance: 2K +/- 1%  Power: 1/16 W  [RES-0402]  (hidden comment: RC0402FR-072KP)
R41  Resistance: 10k  Power: 1/16W  [RES-0402]  (hidden comment: RC0402FR-0710KL)
R42  Resistance: 2K +/- 1%  Power: 1/16 W  [RES-0402]  (hidden comment: RC0402FR-072KP)
R43  Resistance: 10k  Power: 1/16W  [RES-0402]  (hidden comment: RC0402FR-0710KL)
R44  Resistance: 2K +/- 1%  Power: 1/16 W  [RES-0402]  (hidden comment: RC0402FR-072KP)
R45  Resistance: 10k  Power: 1/16W  [RES-0402]  (hidden comment: RC0402FR-0710KL)

### Ports
BAT_ADC (out, see MCU[1B], MCU[3C]), ENC_SPI_CLK (bidir, see Encoder[2C], MCU[4B]), ENC_SPI_MISO (out, see Encoder[2C], MCU[1C]), ENC_SPI_MOSI (out, see Encoder[2C], MCU[1C]), EXTERNAL_CS (in, see MCU[1B]), HALLA_OUT (out, see MCU[1C], MCU[3C]), HALLB_OUT (out, see MCU[1D], MCU[3D]), HALLC_OUT (out, see MCU[1D], MCU[4D]), I2C_SCL (bidir, see MCU[4B]), I2C_SDA (bidir, see MCU[4B]), LIMIT_A (out, see MCU[4B]), LIMIT_B (out, see MCU[4B]), SHA (out, see Driver[4C], FETs[1B]), SHB (out, see Driver[4B], FETs[3B]), SHC (out, see Driver[4B], FETs[4B])

### Nets
3V3_LDO: F2.1 F3.1 R40.2 R42.2 R44.2  [project net VBAT]
5V_BUCK: J2.5
GND: C30.2 C58.1 C62.2 C63.2 C64.2 D7.2 J2.4 J3.3 J5.2 J5.4 J8.6 Q12.5 Q12.6 R4.1 R39.2
VBATT: C58.2 D7.1 J4.2 R38.1
VBATT_FUSED: R3.2
CLK: J8.2 ; port ENC_SPI_CLK
HALLA_IN: J2.1 R40.1 R41.1
HALLB_IN: J2.2 R42.1 R43.1
HALLC_IN: J2.3 R44.1 R45.1
MISO: J8.4 ; port ENC_SPI_MISO
MOSI: J8.5 ; port ENC_SPI_MOSI
MOTOR_A: J6.1 ; port SHA
MOTOR_B: J6.2 ; port SHB
MOTOR_C: J6.3 ; port SHC
REV_G: Q12.4 R38.2 R39.1
NetC30_1: C30.1 R3.1 R4.2 ; port BAT_ADC
NetC62_1: C62.1 R41.2 ; port HALLA_OUT
NetC63_1: C63.1 R43.2 ; port HALLB_OUT
NetC64_1: C64.1 R45.2 ; port HALLC_OUT
NetF2_2: F2.2 J3.1
NetF3_2: F3.2 J8.1
NetJ3_2: J3.2 ; port I2C_SDA
NetJ3_4: J3.4 ; port I2C_SCL
NetJ4_1: J4.1 Q12.1 Q12.2 Q12.3
NetJ5_1: J5.1 ; port LIMIT_A
NetJ5_3: J5.3 ; port LIMIT_B
NetJ8_3: J8.3 ; port EXTERNAL_CS

Not connected (* = marked no-connect by the designer): J2 6; J6 4

### Notes on the sheet
- BATTERY REVERSE POLARITY
- (near J2) SENSOR CONNECTOR
- BATTERY VOLTAGE
- MOTOR CONNECTOR
- @60V, 3.23V ADC
- @36V, 1.94V ADC
- (near J5) LIMIT SWITCHES
- HALL FILTERING
- (near F2) EXTERNAL ENCODER I2C PORT
- (near F3) EXTERNAL ENCODER SPI PORT
- MOTOR TEMP CALCULATIONS:
- TOTAL THERMAL RES: 2.06K/W
- WINDING THERMAL TIME CONSTANT: 9.19s
- 30A W/ NO EMF: 218.5 C ABOVE STARTING
- 25 C TO 125 C IN 5.6s USING EXP TIME CONSTANT
- LIMIT IN SOFTWARE FOR 2-3s
- (in symbol CAP-100U-0001) +

### Library data of the parts
C30 = CAP-1U-0002: CAP CER 100NF 100V X7R 0603; Device Class: Ceramic; Size: 0603
C58 = CAP-100U-0001: CAP ALUM 100UF 20% 100V SMD; Device Class: Electrolytic; ComponentLink1Description: Datasheet; ComponentLink1URL: https://industrial.panasonic.com/cdbs/www-data/pdf/RDE0000/ABA0000C1190.pdf
C62-C64 = CAP-3.9N-0001: 3900 pF ±5% 50V Ceramic Capacitor X7R 0402 (1005 Metric)
D7 = DIO-TVS-0001: TVS DIODE 40VWM 64.5VC DO214AA; ComponentLink1Description: Datasheet; ComponentLink1URL: https://www.littelfuse.com/media?resourcetype=datasheets&itemid=09a6ae9a-73cb-4ac4-acac-e6dab92ab953&filename=littelfuse_tvs_diode_smbj_datasheet.pdf
F2 F3 = FUSE-0002: FUSE BRD MT 250MA 32VAC 32VDC; ComponentLink2Description: Datasheet; ComponentLink2URL: https://www.littelfuse.com/media?resourcetype=datasheets&itemid=4a59f034-1cca-460e-a5ba-e1e66247c76d&filename=littelfuse_fuse_467_datasheet.pdf
J2 J8 = CONN-6POS-0001: CONN HEADER VERT 6POS 3MM; ComponentLink1Description: Datasheet; ComponentLink1URL: https://tools.molex.com/pdm_docs/ps/PS-43045.pdf
J3 J5 J6 = CONN-4POS-0002: CONN HEADER VERT 4POS 3MM; ComponentLink1Description: Datasheet; ComponentLink1URL: https://www.molex.com/content/dam/molex/molex-dot-com/products/automated/en-us/salesdrawingpdf/430/43045/430450412_sd.pdf?inline
J4 = CONN-2POS-0003
Q12 = NTMFS6H800NT1G: as Q1 on sheet FETs; RefDes: RefDes
R3 = RES-82.5k-0001: 82.5 kOhms ±1% 0.063W, 1/16W Chip Resistor 0402 (1005 Metric) Moisture Resistant Thick Film; Tolerance: 1%; Size: 0603; ComponentLink1Description: Datasheet; ComponentLink1URL: https://www.lcsc.com/datasheet/lcsc_datasheet_2304140030_YAGEO-RC0603FR-0712KL_C114659.pdf
R4 = RES-4.7k-0001: RES 4.7K OHM 1% 1/10W 0603; Tolerance: 1%; Size: 0603; ComponentLink1Description: Datasheet; ComponentLink1URL: https://www.yageo.com/upload/media/product/products/datasheet/rchip/PYu-RC_Group_51_RoHS_L_12.pdf
R38 = RES-200k-0001: RES SMD 200K OHM 1% 1/10W 0603; Tolerance: 1%; Size: 0603; ComponentLink1Description: Datasheet; ComponentLink1URL: https://www.yageo.com/upload/media/product/products/datasheet/rchip/PYu-RC_Group_51_RoHS_L_12.pdf
R39 = RES-100k-0001: RES SMD 100K OHM 1% 1/10W 0603; Tolerance: 1%; Size: 0603; ComponentLink1Description: Datasheet; ComponentLink1URL: https://www.yageo.com/upload/media/product/products/datasheet/rchip/PYu-RC_Group_51_RoHS_L_12.pdf
R40 R42 R44 = RES-2K-0001: 2 kOhms ±1% 0.063W, 1/16W Chip Resistor 0402 (1005 Metric) Thick Film
R41 R43 R45 = RES-10k-0001: RES 10K OHM 1% 1/16W 0402; Tolerance: 1%; Size: 0402; ComponentLink1Description: Datasheet; ComponentLink1URL: https://www.yageo.com/upload/media/product/products/datasheet/rchip/PYu-RC_Group_51_RoHS_L_12.pdf

## Nets that join several sheets
5V_BUCK: 5V_Buck (10 pins), LDOs (C51.1 I1.3), CAN (C28.1 U4.3), Connectors (J2.5)
GND: Driver (15 pins), FETs (14 pins), MCU (16 pins), 5V_Buck (19 pins), LDOs (12 pins), CAN (8 pins), Encoder (C57.1 U5.5 U5.13), Connectors (15 pins)
VBAT: FETs (R60.1), MCU (17 pins), LDOs (9 pins), CAN (C29.1 R28.2 R29.2 U4.5), Encoder (C57.2 U5.11 U5.12), Connectors (5 pins)
VBATT: 5V_Buck (F1.1), LDOs (TP7.1), Connectors (C58.2 D7.1 J4.2 R38.1)
VBATT_FUSED: Driver (16 pins), FETs (9 pins), 5V_Buck (7 pins), Connectors (R3.2)
CLK: MCU (U2.6), Encoder (U5.2), Connectors (J8.2)
CSN: MCU (U2.40), Encoder (U5.1)
ENABLE: Driver (TP11.1 U1.31), MCU (U2.29)
INHA: Driver (TP15.1 U1.32), MCU (U2.31)
INHB: Driver (TP17.1 U1.34), MCU (U2.28)
INHC: Driver (TP19.1 U1.36), MCU (U2.26)
INLA: Driver (TP16.1 U1.33), MCU (U2.30)
INLB: Driver (TP18.1 U1.35), MCU (U2.27)
INLC: Driver (TP20.1 U1.37), MCU (U2.25)
MISO: MCU (U2.32), Encoder (U5.3), Connectors (J8.4)
MOSI: MCU (U2.33), Encoder (U5.4), Connectors (J8.5)
MOTOR_A: Driver (U1.7), FETs (6 pins), Connectors (J6.1)
MOTOR_B: Driver (U1.14), FETs (6 pins), Connectors (J6.2)
MOTOR_C: Driver (U1.17), FETs (6 pins), Connectors (J6.3)
NetC9_1: Driver (U1.9), FETs (C9.1 R33.1)
NetC9_2: Driver (U1.10), FETs (C9.2 R52.1)
NetC10_1: Driver (U1.12), FETs (C10.1 R34.1)
NetC10_2: Driver (U1.11), FETs (C10.2 R53.1)
NetC11_1: Driver (U1.19), FETs (C11.1 R35.1)
NetC11_2: Driver (U1.20), FETs (C11.2 R54.1)
NetC30_1: MCU (TP22.1 U2.12), Connectors (C30.1 R3.1 R4.2)
NetC31_1: FETs (C31.1 R19.1 R60.2), MCU (TP24.1 U2.8)
NetC62_1: MCU (TP23.1 U2.47), Connectors (C62.1 R41.2)
NetC63_1: MCU (TP25.1 U2.22), Connectors (C63.1 R43.2)
NetC64_1: MCU (TP26.1 U2.24), Connectors (C64.1 R45.2)
NetJ3_2: MCU (U2.5), Connectors (J3.2)
NetJ3_4: MCU (U2.16), Connectors (J3.4)
NetJ5_1: MCU (U2.3), Connectors (J5.1)
NetJ5_3: MCU (U2.2), Connectors (J5.3)
NetJ8_3: MCU (U2.9), Connectors (J8.3)
NetR6_2: Driver (U1.6), FETs (R6.2)
NetR7_2: Driver (U1.15), FETs (R7.2)
NetR8_2: Driver (U1.16), FETs (R8.2)
NetR25_2: MCU (U2.38), CAN (R25.2)
NetR26_2: MCU (U2.39), CAN (R26.2)
NetR31_2: Driver (U1.8), FETs (R31.2)
NetR32_2: Driver (U1.13), FETs (R32.2)
NetR36_2: Driver (U1.18), FETs (R36.2)
NFAULT: Driver (R2.1 TP10.1 U1.26), MCU (U2.34)
NSCS: Driver (U1.30), MCU (U2.4)
RXD: MCU (U2.43), CAN (U4.4)
SCLK: Driver (U1.29), MCU (U2.13)
SDI: Driver (U1.28), MCU (U2.15)
SDO: Driver (R1.1 U1.27), MCU (U2.14)
SOA: Driver (TP12.1 U1.23), MCU (U2.17)
SOB: Driver (TP13.1 U1.22), MCU (U2.18)
SOC: Driver (TP14.1 U1.21), MCU (U2.19)
STB: MCU (U2.42), CAN (R24.1 U4.8)
TXD: MCU (U2.44), CAN (U4.1)